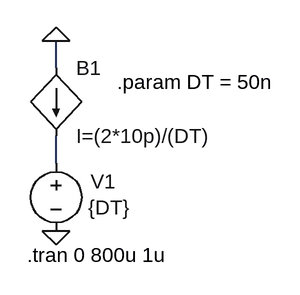
[diagram p0: schematic IsourceDT.asc]
IsourceDT.asc, the LTspice schematic file:
Version 4
SHEET 1 880 680
WIRE 192 112 192 80
WIRE 192 224 192 192
FLAG 192 304 0
FLAG 192 80 0
SYMBOL voltage 192 208 R0
WINDOW 0 41 37 Left 0
WINDOW 3 38 68 Left 0
WINDOW 123 0 0 Left 0
WINDOW 39 0 0 Left 0
SYMATTR InstName V1
SYMATTR Value {DT}
SYMBOL bi 192 112 R0
SYMATTR InstName B1
SYMATTR Value I=(2*10p)/(DT)
TEXT 158 332 Left 0 !.tran 0 800u 1u
TEXT 264 128 Left 0 !.param DT = 50n

The netlist it stands for:
* IsourceDT.asc
V1 N001 0 {DT}
B1 0 N001 I=(2*10p)/(DT)
.tran 0 800u 1u
.param DT = 50n
.backanno
.end